# Altium project Pinger V1.0.0.PrjPcb
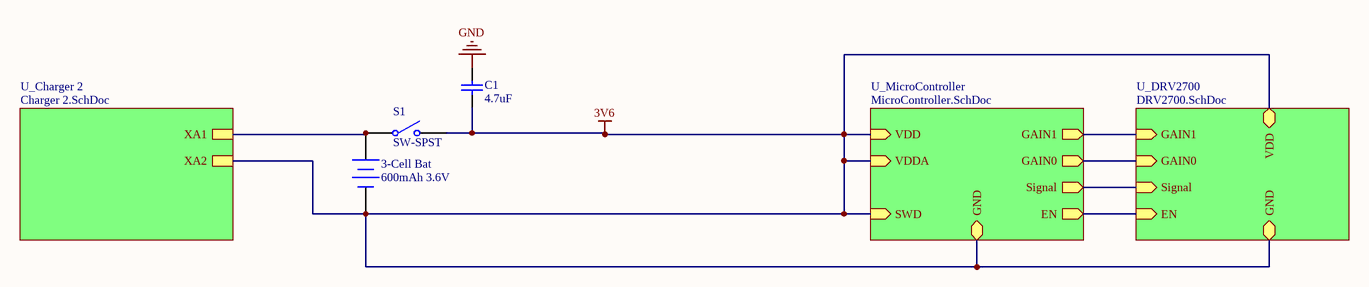
[diagram p0: Master Schematic Sheet.SchDoc]
5 sheets, 74 parts. Net scope: hierarchical (ports join the sheet entries above them; power ports are global).
Board file: PCB1.PcbDoc
Sheets:
  Master Schematic Sheet.SchDoc
    U_Charger 2 = Charger 2.SchDoc
    U_MicroController = MicroController.SchDoc
    U_DRV2700 = DRV2700.SchDoc
  Charger.SchDoc

## Sheet Master Schematic Sheet.SchDoc
size A4

### Parts
(Parts that share a designator on the sheet are numbered #1, #2 ... from top to bottom, then left to right.)
3-Cell_Bat  600mAh 3.6V
C1#1  value 4.7uF  [RAD-0.3]  (hidden comment: Cap)
S1  SW-SPST  [SPST-2]

### Sub-sheets
U_Charger 2 = Charger 2.SchDoc: XA1, XA2
U_DRV2700 = DRV2700.SchDoc: EN (in), GAIN0 (in), GAIN1 (in), Signal (in), VDD, GND
U_MicroController = MicroController.SchDoc: GAIN1 (out), GAIN0 (out), Signal (out), EN (out), VDD (in), VDDA (in), GND, SWD (in)

### Nets
3V6: 3-Cell_Bat.2(-) C1#1.2 S1.2(NO) ; sheet U_Charger 2/XA2, sheet U_MicroController/VDD, sheet U_MicroController/VDDA, sheet U_MicroController/GND, sheet U_MicroController/SWD, sheet U_DRV2700/VDD, sheet U_DRV2700/GND
3V75: 3-Cell_Bat.1(+) S1.1(COMMON) ; sheet U_Charger 2/XA1
GND: C1#1.1
NetC1#4_2: sheet U_MicroController/Signal, sheet U_DRV2700/Signal
NetDRV_19: sheet U_MicroController/GAIN1, sheet U_DRV2700/GAIN1
NetDRV_20: sheet U_MicroController/EN, sheet U_DRV2700/EN
NetSTM_12: sheet U_MicroController/GAIN0, sheet U_DRV2700/GAIN0

### Library data of the parts
3-Cell_Bat = Battery: Multicell Battery; Published: 24-Mar-1999; LatestRevisionDate: 17-Jul-2002; LatestRevisionNote: Re-released for DXP Platform.; PackageReference: BAT-2; Publisher: Altium Limited; PackageDescription: Battery; 2 Leads
C1#1 = Cap: Capacitor; Published: 8-Jun-2000; LatestRevisionDate: 17-Jul-2002; LatestRevisionNote: Re-released for DXP Platform.; PackageReference: RAD-0.3; Publisher: Altium Limited; PackageDescription: Radial Cap, Thru-Hole; 2 Leads; 0.3 in Pin Spacing
S1 = SW-SPST: Single-Pole, Single-Throw Switch; Published: 24-Mar-1999; LatestRevisionDate: 17-Jul-2002; LatestRevisionNote: Re-released for DXP Platform.; PackageReference: SPST-2; Publisher: Altium Limited; PackageDescription: Switch; 2 Leads

## Sheet Charger 2.SchDoc
size A4
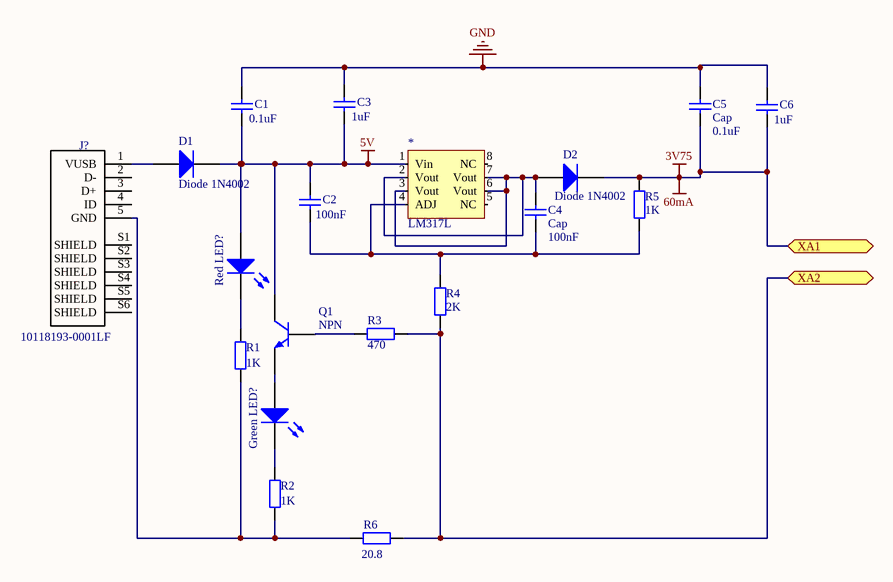
[diagram p1: Charger 2.SchDoc]

### Parts
(Parts that share a designator on the sheet are numbered #1, #2 ... from top to bottom, then left to right.)
*#1  LM317L  [*SOIC127P600X175-8N]
C1#2  value 0.1uF  [RAD-0.3]  (hidden comment: Cap)
C2#1  value 100nF  [RAD-0.3]  (hidden comment: Cap)
C3#1  value 1uF  [RAD-0.3]  (hidden comment: Cap)
C4#1  Cap  value 100nF  [RAD-0.3]
C5#1  Cap  value 0.1uF  [RAD-0.3]
C6#1  value 1uF  [RAD-0.3]  (hidden comment: Cap)
D1  Diode 1N4002  [DO-41]
D2  Diode 1N4002  [DO-41]
Green_LED?  (no value)  [3.2X1.6X1.1]
J?#1  10118193-0001LF  [*FCI_10118193-0001LF_10118193-0001LF(Primary)]
Q1  NPN  [*TO-92]
R1#1  value 1K  [AXIAL-0.4]  (hidden comment: Res2)
R2#1  value 1K  [AXIAL-0.4]  (hidden comment: Res2)
R3  value 470  [AXIAL-0.4]  (hidden comment: Res2)
R4  value 2K  [AXIAL-0.4]  (hidden comment: Res2)
R5  value 1K  [AXIAL-0.4]  (hidden comment: Res2)
R6  value 20.8  [AXIAL-0.4]  (hidden comment: Res2)
Red_LED?  (no value)  [LED-1]

### Ports
XA1, XA2

### Nets
3V6: R3.2 R4.2 R6.1 ; port XA2
3V75: C5#1.1 C6#1.1 D2.2(K) R5.1 ; port XA1
5V: *#1.1(Vin) C1#2.1 C2#1.2 C3#1.1 D1.2(K) Q1.1(C) Red_LED?.1(A)
GND: C1#2.2 C3#1.2 C5#1.2 C6#1.2
Net*#1_2: *#1.2(Vout) *#1.3(Vout) *#1.6(Vout) *#1.7(Vout) C4#1.2 D2.1(A)
Net*#1_4: *#1.4(ADJ) C2#1.1 C4#1.1 R4.1 R5.2
NetD1_1: D1.1(A) J?#1.1(VUSB)
NetGreen_LED?_1: Green_LED?.1(A) Q1.3(E)
NetGreen_LED?_2: Green_LED?.2(K) R2#1.2
NetJ?#1_5: J?#1.5(GND) R1#1.1 R2#1.1 R6.2
NetQ1_2: Q1.2(B) R3.1
NetR1#1_2: R1#1.2 Red_LED?.2(K)

Not connected (* = marked no-connect by the designer): *#1 5(NC) 8(NC); J?#1 2(D-) 3(D+) 4(ID) S1(SHIELD) S2(SHIELD) S3(SHIELD) S4(SHIELD) S5(SHIELD) S6(SHIELD)

### Notes on the sheet
- Labels drawn without touching a wire or pin: 60mA

### Library data of the parts
C1#2 C2#1 C3#1 C4#1 C5#1 C6#1 = Cap: Capacitor; Published: 8-Jun-2000; LatestRevisionDate: 17-Jul-2002; LatestRevisionNote: Re-released for DXP Platform.; PackageReference: RAD-0.3; Publisher: Altium Limited; PackageDescription: Radial Cap, Thru-Hole; 2 Leads; 0.3 in Pin Spacing
D1 D2 = Diode 1N4002: 1 Amp General Purpose Rectifier; Published: 8-Jun-2000; LatestRevisionDate: 17-Jul-2002; LatestRevisionNote: Re-released for DXP Platform.; DatasheetVersion: 1998; PackageVersion: Aug-1999; PackageReference: DO-41; Publisher: Altium Limited; PackageDescription: Diode, Axial; Body 5.2 x 2.7 mm (LxDia. max), Lead Dia. 0.86 mm (max); Code_JEDEC: DO-204-AL; ComponentLink1Description: Manufacturer Link; ComponentLink1URL: http://www.fairchildsemi.com/; ComponentLink2Description: Datasheet; ComponentLink2URL: http://www.fairchildsemi.com/ds/1N%2F1N4001.pdf
Green_LED? = LED2: Typical RED, GREEN, YELLOW, AMBER GaAs LED; Published: 8-Jun-2000; LatestRevisionDate: 17-Jul-2002; LatestRevisionNote: Re-released for DXP Platform.; PackageVersion: Feb-2002; PackageReference: 3.2X1.6X1.1; Publisher: Altium Limited; PackageDescription: SM LED; 2 Flat Leads
J?#1 = 10118193-0001LF: Single Port 5 Contact Shielded SMT MICRO USB B-Type Receptacle; MF: Amphenol ICC; Availability: Unavailable; SnapEDA_Link: https://www.snapeda.com/parts/10118193-0001LF/Amphenol%20ICC/view-part/?ref=snap; MP: 10118193-0001LF; Price: None; Package: None; Value: *
Q1 = QNPN: NPN Bipolar Transistor; Published: 8-Jun-2000; LatestRevisionDate: 29-May-2009; LatestRevisionNote: IPC-7351 Footprint Added.; PackageVersion: Aug-1999; PackageReference: SOT-23B; Publisher: Altium Limited; PackageDescription: 3-Pin SOT-23 Package 0.95 mm Pitch, 2.4 mm Lead Span
R1#1 R2#1 R3-R6 = Res2: Resistor; Published: 8-Jun-2000; LatestRevisionDate: 17-Jul-2002; LatestRevisionNote: Re-released for DXP Platform.; PackageReference: AXIAL-0.4; Publisher: Altium Limited; PackageDescription: Axial Device, Thru-Hole; 2 Leads; 0.4 in Pin Spacing
Red_LED? = LED1: Typical RED GaAs LED; Published: 8-Jun-2000; LatestRevisionDate: 08-Jul-2005; LatestRevisionNote: Mech Layer 1 removed.; PackageReference: LED-1; Publisher: Altium Limited; PackageDescription: LED; 2 Leads

## Sheet MicroController.SchDoc
size A4; CompanyName: AUVIC; DrawnBy: Aman Nijjar; Organization: AUVIC; DocumentNumber: 2; Revision: 0; SheetNumber: 2; SheetTotal: 3; DocumentName: Pinger; ProjectName: Pinger
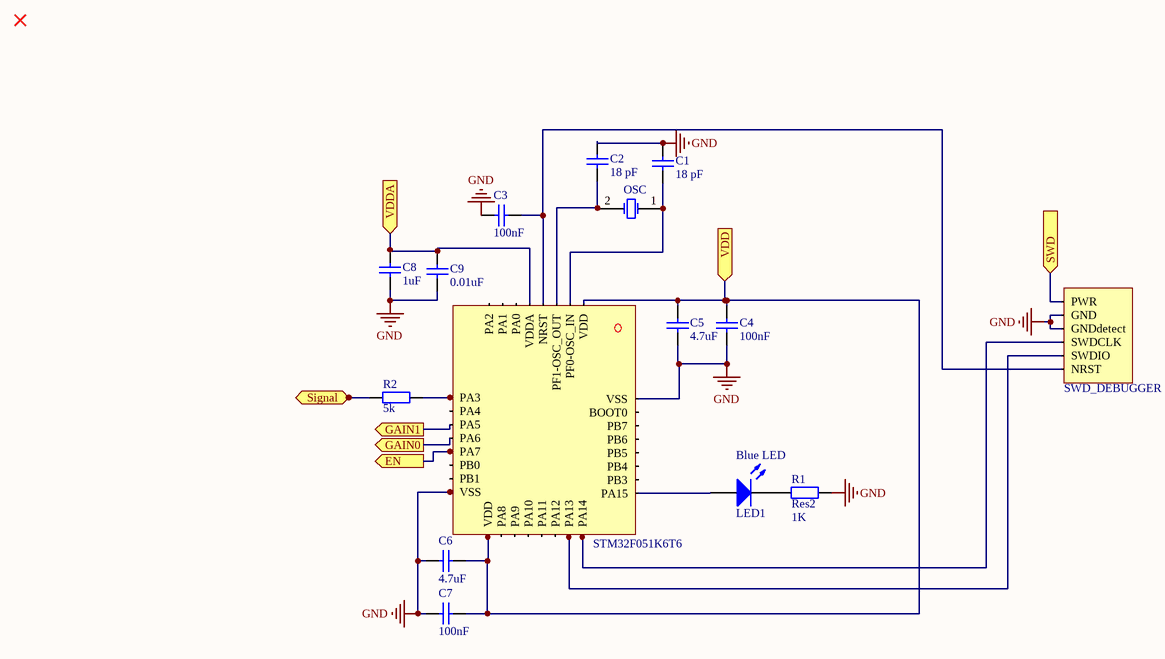
[diagram p2: MicroController.SchDoc]

### Parts
(Parts that share a designator on the sheet are numbered #1, #2 ... from top to bottom, then left to right.)
Blue_LED  LED1  [3.2X1.6X1.1]
C1#3  value 18 pF  [RAD-0.3]  (hidden comment: Cap)
C2#2  value 18 pF  [RAD-0.3]  (hidden comment: Cap)
C3#2  value 100nF  [RAD-0.3]  (hidden comment: Cap)
C4#2  value 100nF  [RAD-0.3]  (hidden comment: Cap)
C5#2  value 4.7uF  [RAD-0.3]  (hidden comment: Cap)
C6#2  value 4.7uF  [RAD-0.3]  (hidden comment: Cap)
C7  value 100nF  [RAD-0.3]  (hidden comment: Cap)
C8  value 1uF  [RAD-0.3]  (hidden comment: Cap)
C9  value 0.01uF  [RAD-0.3]  (hidden comment: Cap)
DEBUG  SWD_DEBUGGER  [Male_header]
OSC  ABMM2-14.7456MHZ-E2-T  [R38]  (value not drawn)
R1#2  Res2  value 1K  [AXIAL-0.4]
R2#2  value 5k  [AXIAL-0.4]  (hidden comment: Res2)
STM  STM32F051K6T6  [TQFP68P900X900X160-32N]

### Ports
EN (out), GAIN0 (out), GAIN1 (out), Signal (out), SWD (in), VDD (in), VDDA (in)

### Nets
3V6: C4#2.1 C5#2.1 C6#2.1 C7.1 C8.1 C9.1 DEBUG.1(PWR) STM.17(VDD) ; port VDD, port VDDA, port SWD
GND: C1#3.2 C2#2.2 C3#2.1 C4#2.2 C5#2.2 C6#2.2 C7.2 C8.2 C9.2 DEBUG.2(GND) DEBUG.3(GNDdetect) R1#2.2 STM.16(VSS) STM.32(VSS)
NetBlue_LED_1: Blue_LED.1(A) STM.25(PA15)
NetBlue_LED_2: Blue_LED.2(K) R1#2.1
NetC1#3_1: C1#3.1 OSC.1(OSC1)
NetC1#4_2: R2#2.1 ; port Signal
NetC2#2_1: C2#2.1 OSC.2(OSC2) STM.3(PF1-OSC_OUT)
NetC3#2_2: C3#2.2 DEBUG.6(NRST) STM.4(NRST)
NetDEBUG_4: DEBUG.4(SWDCLK) STM.24(PA14)
NetDEBUG_5: DEBUG.5(SWDIO) STM.23(PA13)
NetDRV_19: STM.11(PA5) ; port GAIN1
NetDRV_20: STM.13(PA7) ; port EN
NetR2#2_2: R2#2.2 STM.9(PA3)
NetSTM_12: STM.12(PA6) ; port GAIN0

Not connected (* = marked no-connect by the designer): STM 1(VDD) 2(PF0-OSC_IN) 5(VDDA) 6(PA0) 7(PA1) 8(PA2) 10(PA4) 14(PB0) 15(PB1) 18(PA8) 19(PA9) 20(PA10) 21(PA11) 22(PA12) 26(PB3) 27(PB4) 28(PB5) 29(PB6) 30(PB7) 31(BOOT0)

### Library data of the parts
Blue_LED = LED2: as Green_LED? on sheet Charger 2; Published: 8-Jun-2000; LatestRevisionDate: 17-Jul-2002; LatestRevisionNote: Re-released for DXP Platform.; PackageVersion: Feb-2002; PackageReference: 3.2X1.6X1.1; Publisher: Altium Limited; PackageDescription: SM LED; 2 Flat Leads
C1#3 C2#2 C3#2 C4#2 C5#2 C6#2 C7-C9 = Cap: Capacitor; Published: 8-Jun-2000; LatestRevisionDate: 17-Jul-2002; LatestRevisionNote: Re-released for DXP Platform.; PackageReference: RAD-0.3; Publisher: Altium Limited; PackageDescription: Radial Cap, Thru-Hole; 2 Leads; 0.3 in Pin Spacing
DEBUG = SWD_Header
OSC = XTAL: Crystal Oscillator; Published: 8-Jun-2000; LatestRevisionDate: 17-Jul-2002; LatestRevisionNote: Re-released for DXP Platform.; PackageReference: R38; Publisher: Altium Limited; PackageDescription: Crystal, Thru-Hole; 2 Leads; Body 3.1 x 8.2 mm (Dia.xH)
R1#2 R2#2 = Res2: Resistor; Published: 8-Jun-2000; LatestRevisionDate: 17-Jul-2002; LatestRevisionNote: Re-released for DXP Platform.; PackageReference: AXIAL-0.4; Publisher: Altium Limited; PackageDescription: Axial Device, Thru-Hole; 2 Leads; 0.4 in Pin Spacing
STM = STM32F051K6T6: Supplier 1: Mouser; Supplier Part Number 1: 511-STM32F051K6T6

## Sheet DRV2700.SchDoc
size A4
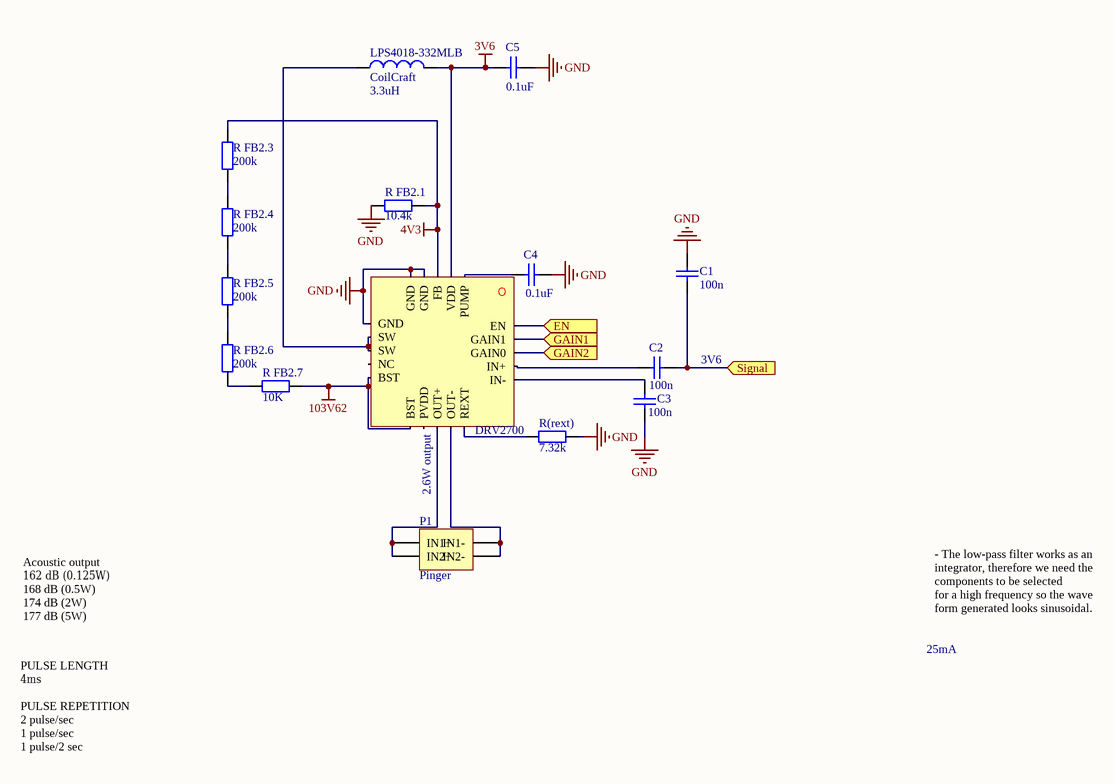
[diagram p3: DRV2700.SchDoc]

### Parts
(Parts that share a designator on the sheet are numbered #1, #2 ... from top to bottom, then left to right.)
C1#4  value 100n  [RAD-0.3]  (hidden comment: Cap)
C2#3  value 100n  [RAD-0.3]  (hidden comment: Cap)
C3#3  value 100n  [RAD-0.3]  (hidden comment: Cap)
C4#3  value 0.1uF  [RAD-0.3]  (hidden comment: +10V rating and X5R or X7R)
C5#3  value 0.1uF  [RAD-0.3]  (hidden comment: +10V rating and X5R or X7R)
DRV  DRV2700  [QFN50P400X400X100_HS-21N]
LPS4018-332MLB  CoilCraft  value 3.3uH  [0402-A]
P1  Pinger  [HDR2X2]
R(rext)  value 7.32k  [AXIAL-0.4]  (hidden comment: Res2)
R_FB2.1  value 10.4k  [AXIAL-0.4]  (hidden comment: Res2)
R_FB2.3  value 200k  [AXIAL-0.4]  (hidden comment: Res2)
R_FB2.4  value 200k  [AXIAL-0.4]  (hidden comment: Res2)
R_FB2.5  value 200k  [AXIAL-0.4]  (hidden comment: Res2)
R_FB2.6  value 200k  [AXIAL-0.4]  (hidden comment: Res2)
R_FB2.7  value 10K  [AXIAL-0.4]  (hidden comment: Res2)

### Ports
EN (in), GAIN1 (in), GAIN2 (in), Signal (in)

### Nets
3V6: C5#3.2 DRV.2(VDD) LPS4018-332MLB.2
4V3: DRV.3(FB) R_FB2.1.2 R_FB2.3.1
103V62: DRV.10(BST) DRV.11(BST) R_FB2.7.2
GND: C1#4.1 C3#3.1 C4#3.1 C5#3.1 DRV.4(GND) DRV.5(GND) DRV.6(GND) R(rext).1 R_FB2.1.1
NetC1#4_2: C1#4.2 C2#3.1 ; port Signal
NetC2#3_2: C2#3.2 DRV.17(IN+)
NetC3#3_2: C3#3.2 DRV.16(IN-)
NetC4#3_2: C4#3.2 DRV.1(PUMP)
NetDRV_7: DRV.7(SW) DRV.8(SW) LPS4018-332MLB.1
NetDRV_13: DRV.13(OUT+) P1.1(IN1+) P1.3(IN2+)
NetDRV_14: DRV.14(OUT-) P1.2(IN1-) P1.4(IN2-)
NetDRV_15: DRV.15(REXT) R(rext).2
NetDRV_18: DRV.18(GAIN0) ; port GAIN2
NetDRV_19: DRV.19(GAIN1) ; port GAIN1
NetDRV_20: DRV.20(EN) ; port EN
NetR_FB2.3_2: R_FB2.3.2 R_FB2.4.1
NetR_FB2.4_2: R_FB2.4.2 R_FB2.5.1
NetR_FB2.5_2: R_FB2.5.2 R_FB2.6.1
NetR_FB2.6_2: R_FB2.6.2 R_FB2.7.1

Not connected (* = marked no-connect by the designer): DRV 9(NC) 12(PVDD)

### Notes on the sheet
- (near C2#3) 3V6
- (near DRV) 2.6W output
- Acoustic output
  ​162 dB (0.125W)
  168 dB (0.5W)
  174 dB (2W)
  177 dB (5W)
- 25mA
- - The low-pass filter works as an integrator, therefore we need the components to be selected
  for a high frequency so the wave form generated looks sinusoidal.
- PULSE LENGTH
  ​4ms
  PULSE REPETITION
  2 pulse/sec
  1 pulse/sec
  1 pulse/2 sec

### Library data of the parts
C1#4 C4#3 C5#3 = Cap: Capacitor; Published: 8-Jun-2000; LatestRevisionDate: 17-Jul-2002; LatestRevisionNote: Re-released for DXP Platform.; PackageReference: RAD-0.3; Publisher: Altium Limited; PackageDescription: Radial Cap, Thru-Hole; 2 Leads; 0.3 in Pin Spacing
C2#3 = Cap: must have 105V rating; Published: 8-Jun-2000; LatestRevisionDate: 17-Jul-2002; LatestRevisionNote: Re-released for DXP Platform.; PackageReference: RAD-0.3; Publisher: Altium Limited; PackageDescription: Radial Cap, Thru-Hole; 2 Leads; 0.3 in Pin Spacing
C3#3 = Cap: must have a 105V rating; Published: 8-Jun-2000; LatestRevisionDate: 17-Jul-2002; LatestRevisionNote: Re-released for DXP Platform.; PackageReference: RAD-0.3; Publisher: Altium Limited; PackageDescription: Radial Cap, Thru-Hole; 2 Leads; 0.3 in Pin Spacing
LPS4018-332MLB = Inductor: Code_IEC: 1005; Published: 8-Jun-2000; LatestRevisionDate: 29-May-2009; LatestRevisionNote: IPC-7351 Footprint Added.; PackageReference: 0402-A; Publisher: Altium Limited; PackageDescription: Chip Inductor; Code_JEITA: 0402
P1 = Header 2X2: Header, 2-Pin, Dual row; LatestRevisionDate: 17-Jul-2002; LatestRevisionNote: Re-released for DXP Platform.; Publisher: Altium Limited
R(rext) = Res2: Current-Limiting Control Resistor; Published: 8-Jun-2000; LatestRevisionDate: 17-Jul-2002; LatestRevisionNote: Re-released for DXP Platform.; PackageReference: AXIAL-0.4; Publisher: Altium Limited; PackageDescription: Axial Device, Thru-Hole; 2 Leads; 0.4 in Pin Spacing
R_FB2.1 R_FB2.3-R_FB2.7 = Res2: Resistor; Published: 8-Jun-2000; LatestRevisionDate: 17-Jul-2002; LatestRevisionNote: Re-released for DXP Platform.; PackageReference: AXIAL-0.4; Publisher: Altium Limited; PackageDescription: Axial Device, Thru-Hole; 2 Leads; 0.4 in Pin Spacing
  R_FB2.3-R_FB2.7: Digikey: RC0201FR-07200KL
DRV = DRV2700: Supplier 1: Mouser; Supplier Part Number 1: 595-DRV2700RGPT

## Sheet Charger.SchDoc
size A
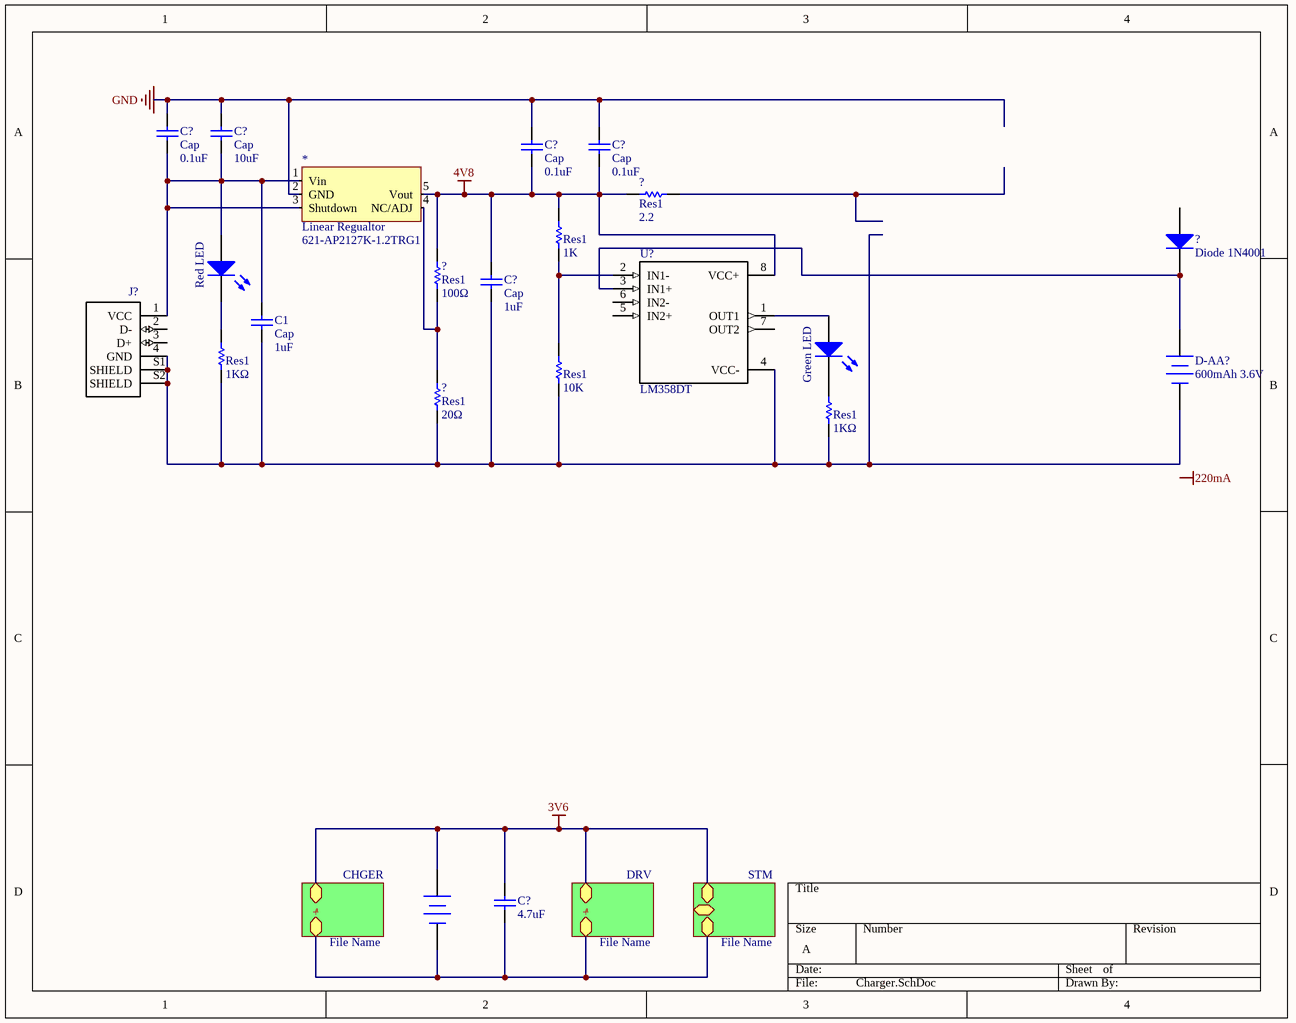
[diagram p4: Charger.SchDoc]

### Parts
(Parts that share a designator on the sheet are numbered #1, #2 ... from top to bottom, then left to right.)
*#2  Linear Regualtor  Supplier Part Number 1: 621-AP2127K-1.2TRG1  [SOT23-5]
?#1  Res1  value 2.2  [AXIAL-0.3]
?#2  Diode 1N4001  [DO-41]
?#3  Res1  value 1K  [AXIAL-0.3]
?#4  Res1  value 100Ω  [AXIAL-0.3]
?#5  Res1  value 1KΩ  [AXIAL-0.3]
?#6  Res1  value 10K  [AXIAL-0.3]
?#7  Res1  value 20Ω  [AXIAL-0.3]
?#8  Res1  value 1KΩ  [AXIAL-0.3]
C1#5  Cap  value 1uF  [RAD-0.3]
C?#1  Cap  value 0.1uF  [RAD-0.3]
C?#2  Cap  value 10uF  [RAD-0.3]
C?#3  Cap  value 0.1uF  [RAD-0.3]
C?#4  Cap  value 0.1uF  [RAD-0.3]
C?#5  Cap  value 1uF  [RAD-0.3]
C?#6  value 4.7uF  [RAD-0.3]  (hidden comment: Cap)
D-AA?  600mAh 3.6V
Green_LED  (no value)  [3.2X1.6X1.1]
J?#2  1-1734028-1  [*TE_1-1734028-1_1-1734028-1(Primary)]  (value not drawn)
N-?  700mAh 2.4V  [BAT-2]  (value not drawn)
Red_LED  (no value)  [LED-1]
U?  LM358DT  [*SOIC127P600X175-8N]

### Sub-sheets
CHGER = File Name (file not in this document): +, -
DRV = File Name (file not in this document): +, -
STM = File Name (file not in this document): +, -,  (bidir)

### Nets
3V6: C?#6.1 N-?.1(+) ; sheet STM/+, sheet DRV/+, sheet CHGER/+
4V8: *#2.5(Vout) ?#1.2 ?#3.2 ?#4.2 C?#3.1 C?#4.1 C?#5.2 U?.8(VCC+)
GND: *#2.2(GND) C?#1.2 C?#2.2 C?#3.2 C?#4.2
Net*#2_1: *#2.1(Vin) *#2.3(Shutdown) C1#5.2 C?#1.1 C?#2.1 J?#2.1(VCC) Red_LED.1(A)
Net*#2_4: *#2.4(NC/ADJ) ?#4.1 ?#7.2
Net?#2_2: ?#2.2(K) D-AA?.1(+) U?.3(IN1+)
Net?#3_1: ?#3.1 ?#6.2 U?.2(IN1-)
Net?#5_1: ?#5.1 ?#6.1 ?#7.1 ?#8.1 C1#5.1 C?#5.1 D-AA?.2(-) J?#2.4(GND) J?#2.S1(SHIELD) J?#2.S2(SHIELD) U?.4(VCC-)
Net?#5_2: ?#5.2 Red_LED.2(K)
Net?#8_2: ?#8.2 Green_LED.2(K)
NetC?#6_2: C?#6.2 N-?.2(-) ; sheet STM/-, sheet DRV/-, sheet CHGER/-
NetGreen_LED_1: Green_LED.1(A) U?.1(OUT1)

Not connected (* = marked no-connect by the designer): ?#1 1; ?#2 1(A); J?#2 2(D-) 3(D+); U? 5(IN2+) 6(IN2-) 7(OUT2)

### Notes on the sheet
- Labels drawn without touching a wire or pin: 220mA

### Library data of the parts
?#1 ?#3-?#8 = Res1: Resistor; Published: 8-Jun-2000; LatestRevisionDate: 17-Jul-2002; LatestRevisionNote: Re-released for DXP Platform.; PackageReference: AXIAL-0.3; Publisher: Altium Limited; PackageDescription: Axial Device, Thru-Hole; 2 Leads; 0.3 in Pin Spacing
?#2 = Diode 1N4001: 1 Amp General Purpose Rectifier; Published: 8-Jun-2000; LatestRevisionDate: 17-Jul-2002; LatestRevisionNote: Re-released for DXP Platform.; DatasheetVersion: 1998; PackageVersion: Aug-1999; PackageReference: DO-41; Publisher: Altium Limited; PackageDescription: Diode, Axial; Body 5.2 x 2.7 mm (LxDia. max), Lead Dia. 0.86 mm (max); Code_JEDEC: DO-204-AL; ComponentLink1Description: Manufacturer Link; ComponentLink1URL: http://www.fairchildsemi.com/; ComponentLink2Description: Datasheet; ComponentLink2URL: http://www.fairchildsemi.com/ds/1N%2F1N4001.pdf
C1#5 C?#1-C?#6 = Cap: Capacitor; Published: 8-Jun-2000; LatestRevisionDate: 17-Jul-2002; LatestRevisionNote: Re-released for DXP Platform.; PackageReference: RAD-0.3; Publisher: Altium Limited; PackageDescription: Radial Cap, Thru-Hole; 2 Leads; 0.3 in Pin Spacing
D-AA? N-? = Battery: Multicell Battery; Published: 24-Mar-1999; LatestRevisionDate: 17-Jul-2002; LatestRevisionNote: Re-released for DXP Platform.; PackageReference: BAT-2; Publisher: Altium Limited; PackageDescription: Battery; 2 Leads
Green_LED = LED2: as Green_LED? on sheet Charger 2; Published: 8-Jun-2000; LatestRevisionDate: 17-Jul-2002; LatestRevisionNote: Re-released for DXP Platform.; PackageVersion: Feb-2002; PackageReference: 3.2X1.6X1.1; Publisher: Altium Limited; PackageDescription: SM LED; 2 Flat Leads
J?#2 = 1-1734028-1: USB CONN,Plug R/A SMT,Post 1.1,Reel; Product_Type: Connector; Centerline_Pitch: 2 mm[.078 in]; Number_of_Positions: 4; MF: TE Connectivity; Price: None; SnapEDA_Link: https://www.snapeda.com/parts/1-1734028-1/TE%20Connectivity%20AMP%20Connectors/view-part/?ref=snap; MP: 1-1734028-1; Availability: Unavailable; Package: None; TE_purchase_URL: https://www.te.com/usa-en/product-1-1734028-1.html?te_bu=Cor&te_type=disp&te_campaign=seda_glo_cor-seda-global-disp-prtnr-fy19-seda-model-bom-cta_sma-317_1&elqCampaignId=32493; Value: *
Red_LED = LED1: Typical RED GaAs LED; Published: 8-Jun-2000; LatestRevisionDate: 08-Jul-2005; LatestRevisionNote: Mech Layer 1 removed.; PackageReference: LED-1; Publisher: Altium Limited; PackageDescription: LED; 2 Leads
U? = LM358DT: LM358 Series 30 V 1.1 MHz Low Power Dual Operational Amplifier - SOIC-8; MF: STMicroelectronics; MP: LM358DT; SnapEDA_Link: https://www.snapeda.com/parts/LM358DT/STMicroelectronics/view-part/?ref=snap; Digi-Key_Purchase_URL: https://www.digikey.com/product-detail/en/rohm-semiconductor/LM358DT/LM358DTCT-ND/1878968?utm_source=snapeda&utm_medium=aggregator&utm_campaign=symbol; Package: SOIC-8 STMicroelectronics; Digi-Key_Part_Number: LM358DTCT-ND; Value: *
*#2 = Linear Regualtor: Supplier 1: Mouser

## Nets that join several sheets
3V6: Master Schematic Sheet (3-Cell_Bat.2 C1#1.2 S1.2), Charger 2 (R3.2 R4.2 R6.1), MicroController (8 pins), DRV2700 (C5#3.2 DRV.2 LPS4018-332MLB.2), Charger (C?#6.1 N-?.1)
3V75: Master Schematic Sheet (3-Cell_Bat.1 S1.1), Charger 2 (C5#1.1 C6#1.1 D2.2 R5.1)
GND: Master Schematic Sheet (C1#1.1), Charger 2 (C1#2.2 C3#1.2 C5#1.2 C6#1.2), MicroController (14 pins), DRV2700 (9 pins), Charger (5 pins)
NetC1#4_2: MicroController (R2#2.1), DRV2700 (C1#4.2 C2#3.1)
NetDRV_19: MicroController (STM.11), DRV2700 (DRV.19)
NetDRV_20: MicroController (STM.13), DRV2700 (DRV.20)